# Altium project C2Sv0 - Processor.PrjPcb
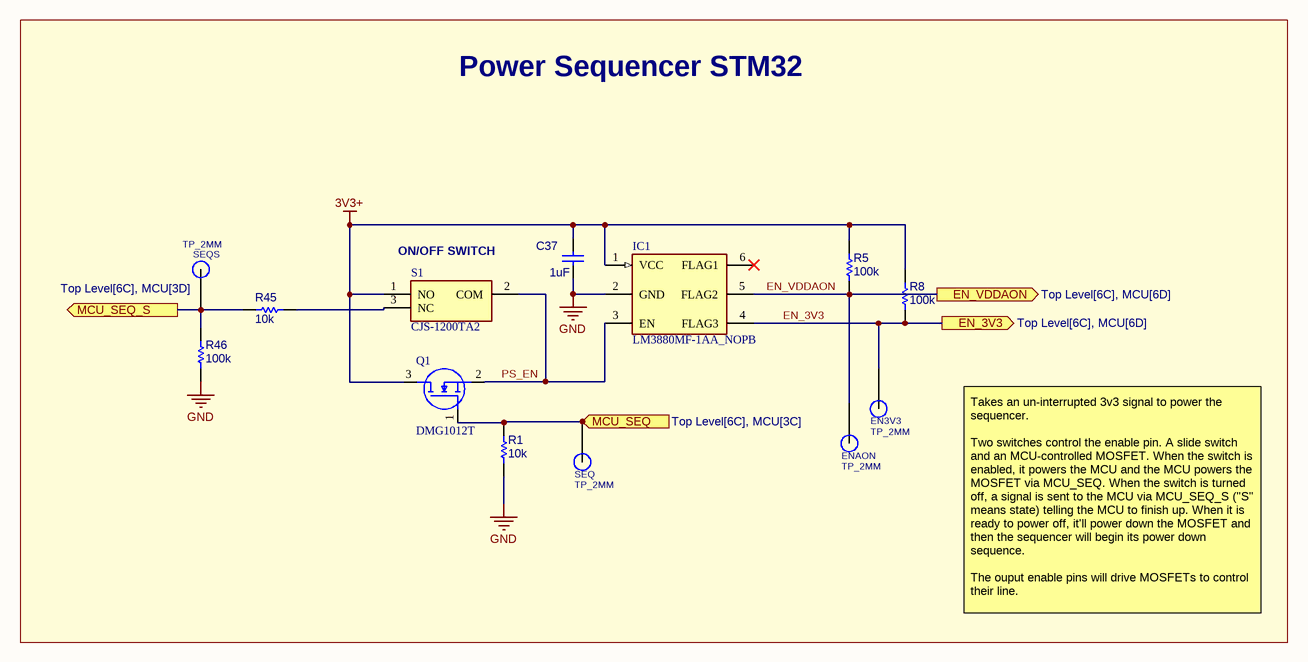
[diagram p0: Sequencer.SchDoc]
4 sheets, 34 parts. Net scope: flat (ports and power ports of the same name join across sheets).
Board file: C2Sv0_PROCESSOR.PcbDoc
Sheets:
  Sequencer.SchDoc
  Clocks.SchDoc
  SWD.SchDoc
  USBC.SchDoc

## Sheet Sequencer.SchDoc
size A4; SheetNumber: 2; SheetTotal: 8

### Parts
C37  value 1uF  [C0603]  (hidden comment: MCD-00237)
EN3V3  TP_2MM  [TESTPOINT 2MM]
ENAON  TP_2MM  [TESTPOINT 2MM]
IC1  LM3880MF-1AA_NOPB  [LM3880MF-1AA_NOPB]
Q1  DMG1012T  [SOT50P160X90-3N]
R1  value 10k  [RESC1608X55X25ML10T15-1]  (hidden comment: Resistor 10k +/-1% 0603 100mW)
R5  value 100k  [RESC1608X55X25ML10T15-1]  (hidden comment: Resistor 10k +/-1% 0603 100mW)
R8  value 100k  [RESC1608X55X25ML10T15-1]  (hidden comment: Resistor 10k +/-1% 0603 100mW)
R45  value 10k  [RESC1608X55X25ML10T15-1]  (hidden comment: Resistor 10k +/-1% 0603 100mW)
R46  value 100k  [RESC1608X55X25ML10T15-1]  (hidden comment: Resistor 10k +/-1% 0603 100mW)
S1  CJS-1200TA2  [CJS1200TA2]
SEQ  TP_2MM  [TESTPOINT 2MM]
SEQS  TP_2MM  [TESTPOINT 2MM]

### Ports
EN_3V3 (out, see Top Level[6C], MCU[6D]), EN_VDDAON (out, see Top Level[6C], MCU[6D]), MCU_SEQ (in, see Top Level[6C], MCU[3C]), MCU_SEQ_S (out, see Top Level[6C], MCU[3D])

### Nets
3V3+: C37.2 IC1.1(VCC) Q1.3(D) R5.1 R8.1 S1.1(NO)
GND: C37.1 IC1.2(GND) R1.2 R46.2
EN_3V3: EN3V3.TP(TP_2MM) IC1.4(FLAG3) R8.2 ; port EN_3V3
EN_VDDAON: ENAON.TP(TP_2MM) IC1.5(FLAG2) R5.2 ; port EN_VDDAON
PS_EN: IC1.3(EN) Q1.2(S) S1.2(COM)
NetQ1_1: Q1.1(G) R1.1 SEQ.TP(TP_2MM) ; port MCU_SEQ
NetR45_1: R45.1 R46.1 SEQS.TP(TP_2MM) ; port MCU_SEQ_S
NetR45_2: R45.2 S1.3(NC)

Not connected (* = marked no-connect by the designer): IC1 6(FLAG1)*

### Notes on the sheet
- Power Sequencer STM32
- (near S1) ON/OFF SWITCH
- Takes an un-interrupted 3v3 signal to power the sequencer.
  Two switches control the enable pin. A slide switch and an MCU-controlled MOSFET. When the switch is enabled, it powers the MCU and the MCU powers the MOSFET via MCU_SEQ. When the switch is turned off, a signal is sent to the MCU via MCU_SEQ_S ("S" means state) telling the MCU to finish up. When it is ready to power off, it'll power down the MOSFET and then the sequencer will begin its power down sequence.
  The ouput enable pins will drive MOSFETs to control their line.

### Library data of the parts
C37 = CMP-112-000001-1: Capacitor, MLCC, 100nF, 6V3, X5R, 10%, 0603, T=0,8mm; Manufacturer Part Number: CC0603KRX5R5BB104; Manufacturer: YAGEO; ECCN_EU: NEC; Provided_By: SUBCO; ECCN_US: EAR99; Status: Released; ComponentLink1Description: Datasheet; Component Type: Capacitors; Pin Count: 2; Package: C0603; Source: MB1364.SCHLIB; Design Item ID: MCD-00237; Part_Type: Capacitor; Internal_Part_Number: MCD-00237; ComponentLink1URL: http://tunmcdsvn.tun.st.com/Component_Datasheet_Library/Trunk/Capacitors/Yageo_Multilayer_capacitor_X5R_series_100pF_to_100uF; Manufacturer_Part_Number: CC0603KRX5R5BB104
IC1 = LM3880MF-1AA_NOPB: Integrated Circuit; Manufacturer_Name: Texas Instruments; Manufacturer_Part_Number: LM3880MF-1AA/NOPB; Datasheet Link: http://www.ti.com/lit/gpn/lm3880; Height: 1.45mm; Mouser Part Number: 926-LM3880MF-1AANOPB; Mouser Price/Stock: https://www.mouser.co.uk/ProductDetail/Texas-Instruments/LM3880MF-1AA-NOPB?qs=QbsRYf82W3Fi03r6kJUy6g%3D%3D; Arrow Part Number: LM3880MF-1AA/NOPB; Arrow Price/Stock: https://www.arrow.com/en/products/lm3880mf-1aanopb/texas-instruments?region=nac
Q1 = DMG1012T: MOSFET (N-Channel); Manufacturer_Name: Diodes Incorporated; Datasheet Link: https://www.diodes.com/datasheet/download/DMG1012T.pdf; Height: 0.9mm; Manufacturer_Part_Number: DMG1012T; Mouser Part Number: N/A; Mouser Price/Stock: https://www.mouser.co.uk/ProductDetail/Diodes-Incorporated/DMG1012T?qs=Wj%2FVkw3K%252BMD5naxckZUW%2FA%3D%3D
R1 R5 R8 R45 R46 = CMP-009-00181-1: Chip Resistor, 10k Ohm, 0.1 W, -55 to 155 degC, 0603 (1608 Metric); Voltage Rating: 50V; Tolerance: 1%; Source: Components - 14.11.22 - 11.28.SchLib; Design Item ID: CMP-009-00006-5; Created by: Micah Randall; Power: 100mW; Max Operating Temperature: 155°C; RoHS Compliant: Yes; Mounting Technology: SM; Case/Package: 0603; Min Operating Temperature: -55°C; Pins: 2
S1 = CJS-1200TA2: Switch; Manufacturer_Name: Nidec Copal; Datasheet Link: http://www.nidec-copal-electronics.com/j/catalog/switch/cjs.pdf; Height: 2.5mm; Manufacturer_Part_Number: CJS-1200TA2; Mouser Part Number: 229-CJS-1200TA2; Mouser Price/Stock: https://www.mouser.co.uk/ProductDetail/Nidec-Components/CJS-1200TA2?qs=XeJtXLiO41Rf26ws0igWdA%3D%3D

## Sheet Clocks.SchDoc
size A4; SheetNumber: 4; SheetTotal: 8
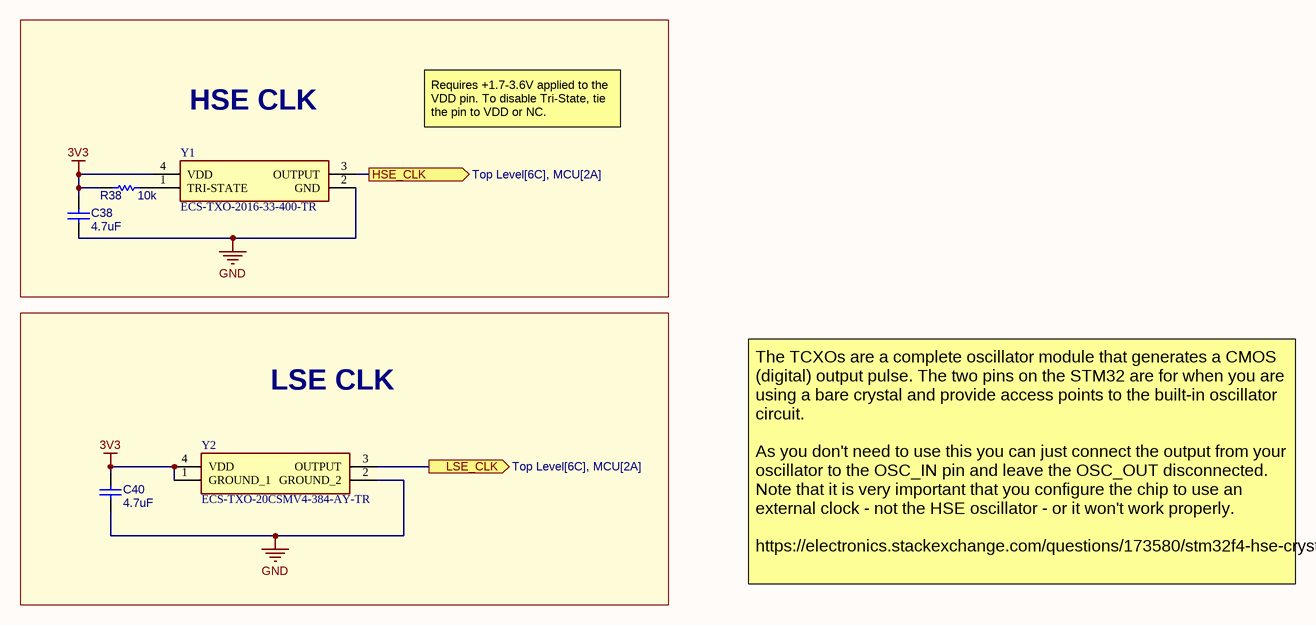
[diagram p1: Clocks.SchDoc]

### Parts
C38  value 4.7uF  [C0603]  (hidden comment: MCD-00237)
C40  value 4.7uF  [C0603]  (hidden comment: MCD-00237)
R38  value 10k  [RESC1608X55X25ML10T15-1]  (hidden comment: Resistor 10k +/-1% 0603 100mW)
Y1  ECS-TXO-2016-33-400-TR  [ECS-TXO-2016-33-400-TR]
Y2  ECS-TXO-20CSMV4-384-AY-TR  [ECS-TXO-20CSMV4-384-AY-TR]

### Blocks framed on the sheet
HSE CLK: C38 R38 Y1
LSE CLK: C40 Y2

### Ports
HSE_CLK (out, see Top Level[6C], MCU[2A]), LSE_CLK (out, see Top Level[6C], MCU[2A])

### Nets
3V3: C38.2 C40.1 R38.1 Y1.4(VDD) Y2.1(GROUND_1) Y2.4(VDD)
GND: C38.1 C40.2 Y1.2(GND) Y2.2(GROUND_2)
NetR38_2: R38.2 Y1.1(TRI-STATE)
NetY1_3: Y1.3(OUTPUT) ; port HSE_CLK
NetY2_3: Y2.3(OUTPUT) ; port LSE_CLK

### Notes on the sheet
- Requires +1.7-3.6V applied to the VDD pin. To disable Tri-State, tie the pin to VDD or NC.
- The TCXOs are a complete oscillator module that generates a CMOS (digital) output pulse. The two pins on the STM32 are for when you are using a bare crystal and provide access points to the built-in oscillator circuit.
  As you don't need to use this you can just connect the output from your oscillator to the OSC_IN pin and leave the OSC_OUT disconnected. Note that it is very important that you configure the chip to use an external clock - not the HSE oscillator - or it won't work properly.
  https://electronics.stackexchange.com/questions/173580/stm32f4-hse-crystal

### Library data of the parts
C38 C40 = CMP-112-000001-1: as C37 on sheet Sequencer; Status: Released; ComponentLink1Description: Datasheet; Component Type: Capacitors; Pin Count: 2; Package: C0603; Source: MB1364.SCHLIB; Design Item ID: MCD-00237; Part_Type: Capacitor; Internal_Part_Number: MCD-00237; ComponentLink1URL: http://tunmcdsvn.tun.st.com/Component_Datasheet_Library/Trunk/Capacitors/Yageo_Multilayer_capacitor_X5R_series_100pF_to_100uF; Manufacturer_Part_Number: CC0603KRX5R5BB104
R38 = CMP-009-00181-1: as R1 on sheet Sequencer; Source: Components - 14.11.22 - 11.28.SchLib; Design Item ID: CMP-009-00006-5; Created by: Micah Randall; Power: 100mW; Max Operating Temperature: 155°C; RoHS Compliant: Yes; Mounting Technology: SM; Case/Package: 0603; Min Operating Temperature: -55°C; Pins: 2
Y1 = ECS-TXO-2016-33-400-TR: Crystal or Oscillator; Manufacturer_Name: ECS; Datasheet Link: https://datasheet.datasheetarchive.com/originals/distributors/Datasheets_SAMA/fdc451124f6f80954f29114af1256858.pdf; Height: 0.8mm; Manufacturer_Part_Number: ECS-TXO-2016-33-400-TR; Mouser Part Number: 520-TXO-2016-33-400T; Mouser Price/Stock: https://www.mouser.co.uk/ProductDetail/ECS/ECS-TXO-2016-33-400-TR?qs=PzGy0jfpSMtctR53CPxRHg%3D%3D; Arrow Part Number: ECS-TXO-2016-33-400-TR; Arrow Price/Stock: https://www.arrow.com/en/products/ecs-txo-2016-33-400-tr/ecs-international?region=nac
Y2 = ECS-TXO-20CSMV4-384-AY-TR: Crystal or Oscillator; Manufacturer_Name: ECS; Datasheet Link: https://ecsxtal.com/store/pdf/ECS-TXO-20CSMV4.pdf; Height: 0.8mm; Manufacturer_Part_Number: ECS-TXO-20CSMV4-384-AY-TR

## Sheet SWD.SchDoc
size A4; SheetNumber: 6; SheetTotal: 9
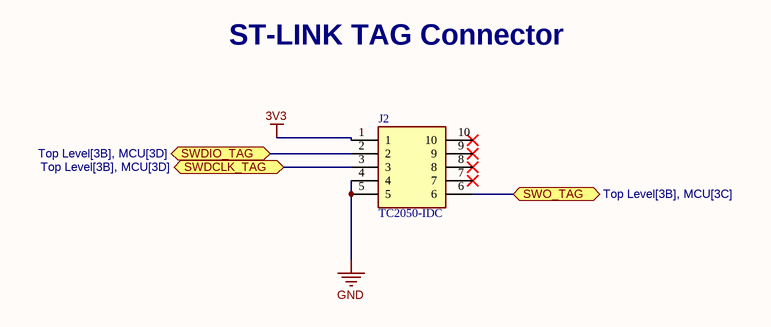
[diagram p2: SWD.SchDoc]

### Parts
J2  TC2050-IDC  [TC2050-IDC]

### Ports
SWDCLK_TAG (bidir, see Top Level[3B], MCU[3D]), SWDIO_TAG (bidir, see Top Level[3B], MCU[3D]), SWO_TAG (bidir, see Top Level[3B], MCU[3C])

### Nets
3V3: J2.1
GND: J2.4 J2.5
NetJ2_2: J2.2 ; port SWDIO_TAG
NetJ2_3: J2.3 ; port SWDCLK_TAG
NetJ2_6: J2.6 ; port SWO_TAG

Not connected (* = marked no-connect by the designer): J2 7* 8* 9* 10*

### Notes on the sheet
- ST-LINK TAG Connector

### Library data of the parts
J2 = TC2050-IDC: Connector; Manufacturer_Name: Tag Connect; Datasheet Link: https://datasheet.datasheetarchive.com/originals/distributors/Datasheets_SAMA/51f607a36a24a0aceedaa5d6ebc30014.pdf; Manufacturer_Part_Number: TC2050-IDC

## Sheet USBC.SchDoc
size A4; SheetNumber: 7; SheetTotal: 9
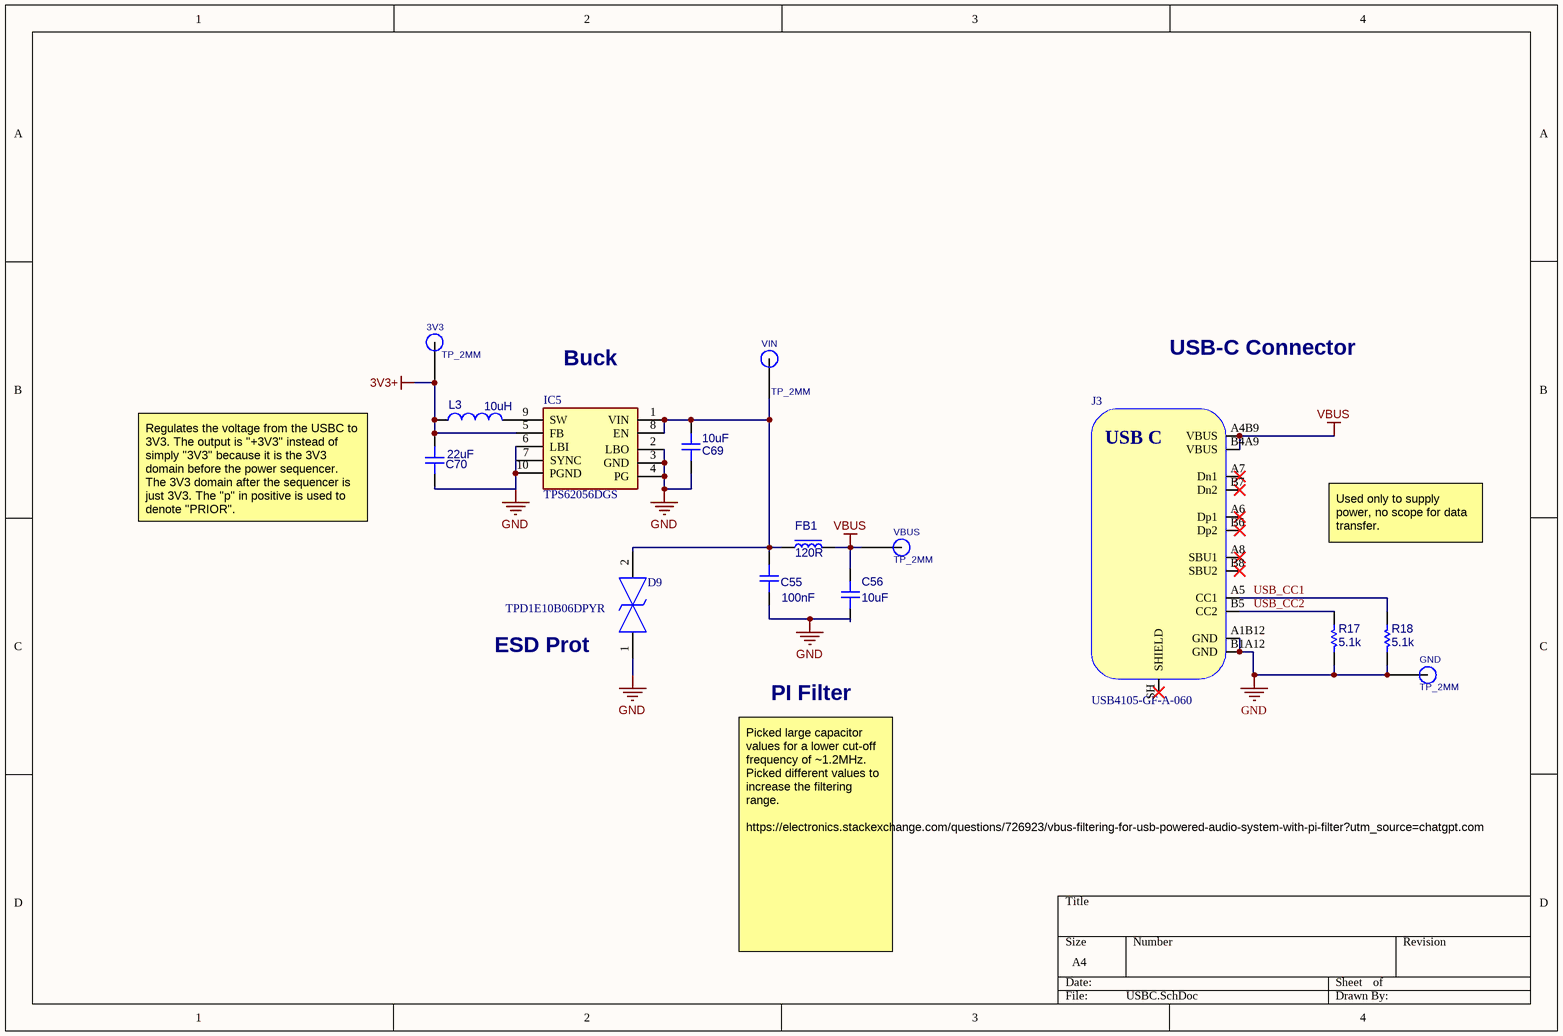
[diagram p3: USBC.SchDoc]

### Parts
3V3  TP_2MM  [TESTPOINT 2MM]
C55  CAP_0603_16V  [CAP_0603]  (value not drawn)
C56  CAP_0603_16V  [CAP_0603]  (value not drawn)
C69  CAP_0603_16V  [CAP_0603]  (value not drawn)
C70  CAP_0603_16V  [CAP_0603]  (value not drawn)
D9  TPD1E10B06DPYR  [TPD1E10B06DPYR]
FB1  120R  [FB_0603]
GND  TP_2MM  [TESTPOINT 2MM]
IC5  TPS62056DGS  [TPS62056DGS]
J3  USB4105-GF-A-060  [USB4105-GF-A-060]
L3  10uH  [INDC1608X90X30LL10T20]
R17  value 5.1k  [RESC1608X55X25ML10T15-1]  (hidden comment: Resistor 10k +/-1% 0603 100mW)
R18  value 5.1k  [RESC1608X55X25ML10T15-1]  (hidden comment: Resistor 10k +/-1% 0603 100mW)
VBUS  TP_2MM  [TESTPOINT 2MM]
VIN  TP_2MM  [TESTPOINT 2MM]

### Nets
3V3+: 3V3.TP(TP_2MM) C70.2 IC5.5(FB) L3.1
GND: C55.1 C56.1 C69.1 C70.1 D9.1 GND.TP(TP_2MM) IC5.2(LBO) IC5.3(GND) IC5.4(PG) IC5.6(LBI) IC5.7(SYNC) IC5.10(PGND) J3.A1B12(GND) J3.B1A12(GND) R17.2 R18.2
VBUS: C56.2 FB1.2 J3.A4B9(VBUS) J3.B4A9(VBUS) VBUS.TP(TP_2MM)
USB_CC1: J3.A5(CC1) R18.1
USB_CC2: J3.B5(CC2) R17.1
NetC55_2: C55.2 C69.2 D9.2 FB1.1 IC5.1(VIN) IC5.8(EN) VIN.TP(TP_2MM)
NetIC5_9: IC5.9(SW) L3.2

Not connected (* = marked no-connect by the designer): J3 A6(Dp1)* A7(Dn1)* A8(SBU1)* B6(Dp2)* B7(Dn2)* B8(SBU2)* SH(SHIELD)*

### Notes on the sheet
- (near IC5) Buck
- USB-C Connector
- (near C69) 10uF
- Regulates the voltage from the USBC to 3V3. The output is "+3V3" instead of simply "3V3" because it is the 3V3 domain before the power sequencer. The 3V3 domain after the sequencer is just 3V3. The "p" in positive is used to denote "PRIOR".
- (near C70) 22uF
- Used only to supply power, no scope for data transfer.
- (near D9) ESD Prot
- (near C55) 100nF
- (near C56) 10uF
- PI Filter
- Picked large capacitor values for a lower cut-off frequency of ~1.2MHz. Picked different values to increase the filtering range.
  https://electronics.stackexchange.com/questions/726923/vbus-filtering-for-usb-powered-audio-system-with-pi-filter?utm_source=chatgpt.com
- (in symbol CMP-005-000042-4) USB C

### Library data of the parts
C55 C56 C69 C70 = CMP-004-000035-1: Capacitor SMD 0603 16V; Source: Schematic-Lib-PhilsLab.SchLib; Design Item ID: CAP_0603_16V
D9 = TPD1E10B06DPYR: TVS Diode (Bi-directional); Manufacturer_Name: Texas Instruments; Datasheet Link: https://www.ti.com/lit/ds/symlink/tpd1e10b06.pdf?HQS=TI-null-null-mousermode-df-pf-null-wwe&ts=1599077798252&ref_url=https%253A%252F%252Fwww.mouser.com%252F; Height: 0.45mm; Manufacturer_Part_Number: TPD1E10B06DPYR; Mouser Part Number: 595-TPD1E10B06DPYR; Mouser Price/Stock: https://www.mouser.co.uk/ProductDetail/Texas-Instruments/TPD1E10B06DPYR?qs=UFc95S4Z4CaJYpQ4xqTc0g%3D%3D; Arrow Part Number: TPD1E10B06DPYR; Arrow Price/Stock: https://www.arrow.com/en/products/tpd1e10b06dpyr/texas-instruments?region=nac
FB1 = CMP-010-000008-1: Ferrite Bead SMD 0603; Source: Schematic-Lib-PhilsLab.SchLib; Design Item ID: FB_0603
IC5 = TPS62056DGS: Integrated Circuit; Manufacturer_Name: Texas Instruments; Datasheet Link: http://componentsearchengine.com/Datasheets/1/TPS62056DGS.pdf; Height: 1.1mm; Manufacturer_Part_Number: TPS62056DGS; Mouser Part Number: 595-TPS62056DGS; Mouser Price/Stock: https://www.mouser.co.uk/ProductDetail/Texas-Instruments/TPS62056DGS?qs=Gse6rAGbi7%252BfbVYUmz7rjA%3D%3D; Arrow Part Number: TPS62056DGS; Arrow Price/Stock: https://www.arrow.com/en/products/tps62056dgs/texas-instruments?region=nac
J3 = CMP-005-000042-4: USB Connector Type C SMT 12 Pin; Manufacturer: GCT; Manufacturer Part Number: USB4105-GF-A-060; Source: Schematic-Lib-PhilsLab.SchLib; Design Item ID: USB4105-GF-A-060
L3 = CMP-2000-05913-1: Unshielded Wirewound Inductor, 33 nH, 350 mA, -55 to 150 degC, 0603 (1608 Metric), RoHS, Tape and Reel; Manufacturer: EPCOS-(TDK); Q @ Freq: 14@100MHz; Inductance: 33nH; Material - Core: Ceramic; Frequency - Self Resonant: 3GHz; DC Resistance (DCR): 600mOhmMax; Tolerance: ±5%; Frequency - Test: 100MHz; Current Rating: 350mA; Manufacturer URL: http://www.tdk.com/; Type: Wirewound; Mounting Type: SurfaceMount; Mounting Technology: SurfaceMount; Height - Seated (Max): 0.035"(0.90mm); Datasheet URL: https://en.tdk.eu/inf/30/db/ind_2008/b82496c.pdf; Shielding: Unshielded; Operating Temperature: -; Size / Dimension: 0.063"Lx0.031"W(1.60mmx0.80mm); Series: SIMID; Current - Saturation: -; Ratings: AEC-Q200; Packaging: CutTape(CT); Package Reference: 0603; Datasheet Version: 07/2016; Category: Inductors,Coils,Chokes; Package Description: 2-Pin Surface Mount Device, Body 1.6 x 0.8 mm; Family: FixedInductors; Package / Case: 0603(1608Metric)
R17 R18 = CMP-009-00181-1: as R1 on sheet Sequencer; Source: Components - 14.11.22 - 11.28.SchLib; Design Item ID: CMP-009-00006-5; Created by: Micah Randall; Power: 100mW; Max Operating Temperature: 155°C; RoHS Compliant: Yes; Mounting Technology: SM; Case/Package: 0603; Min Operating Temperature: -55°C; Pins: 2

## Nets that join several sheets
3V3: Clocks (6 pins), SWD (J2.1)
3V3+: Sequencer (6 pins), USBC (3V3.TP C70.2 IC5.5 L3.1)
GND: Sequencer (C37.1 IC1.2 R1.2 R46.2), Clocks (C38.1 C40.2 Y1.2 Y2.2), SWD (J2.4 J2.5), USBC (16 pins)